# Altium schematic sheet [14]-MAIN_CONNECTORS.SchDoc
size A4
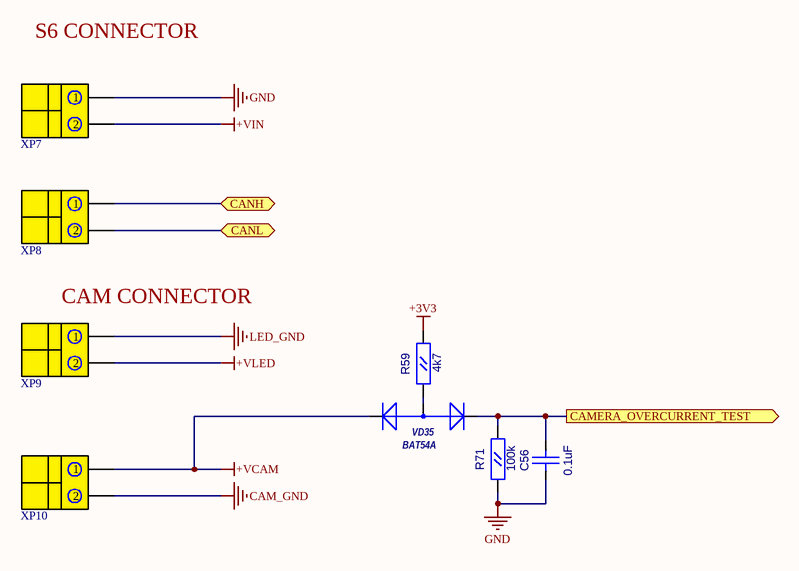
[diagram p0: [14]-MAIN_CONNECTORS.SchDoc]

## Parts
C56  0.1uF  [CC0603]
R59  4k7  [RC0603]
R71  100k  [RC0603]
VD35  BAT54A  [SOT-23(123)]
XP7  DG330-2P  [DG330-2P]  (value not drawn)
XP8  DG330-2P  [DG330-2P]  (value not drawn)
XP9  DG330-2P  [DG330-2P]  (value not drawn)
XP10  DG330-2P  [DG330-2P]  (value not drawn)

## Ports
CAMERA_OVERCURRENT_TEST (out), CANH (bidir), CANL (bidir)

## Nets
+3V3: R59.2(B)
+VCAM: VD35.1(K) XP10.1
+VIN: XP7.2
+VLED: XP9.2
CAM_GND: XP10.2
GND: C56.1(A) R71.1(A) XP7.1
LED_GND: XP9.1
CAMERA_OVERCURRENT_TEST: C56.2(B) R71.2(B) VD35.2(K) ; port CAMERA_OVERCURRENT_TEST
CANH: XP8.1 ; port CANH
CANL: XP8.2 ; port CANL
NetR59_1: R59.1(A) VD35.3(A)

## Notes on the sheet
- (near XP7) S6 CONNECTOR
- (near XP9) CAM CONNECTOR

## Library data of the parts
C56 = CC0603: Value: 0.1uF
R59 R71 = RC0603
  R59: Value: 4k7
  R71: Value: 100k
VD35 = BAT54A: 1.0 Ampere General Purpose Rectifier; ComponentField6: Published 8-Jun-2000, Modified 11-July-2000: SIM Model Added.; Value: *
XP7-XP10 = DG330-2P: Degson 2 pin connector rear; Value: DG330-2P